# Altium schematic sheet 12V_to_5V_LDO_1A.SchDoc
size A
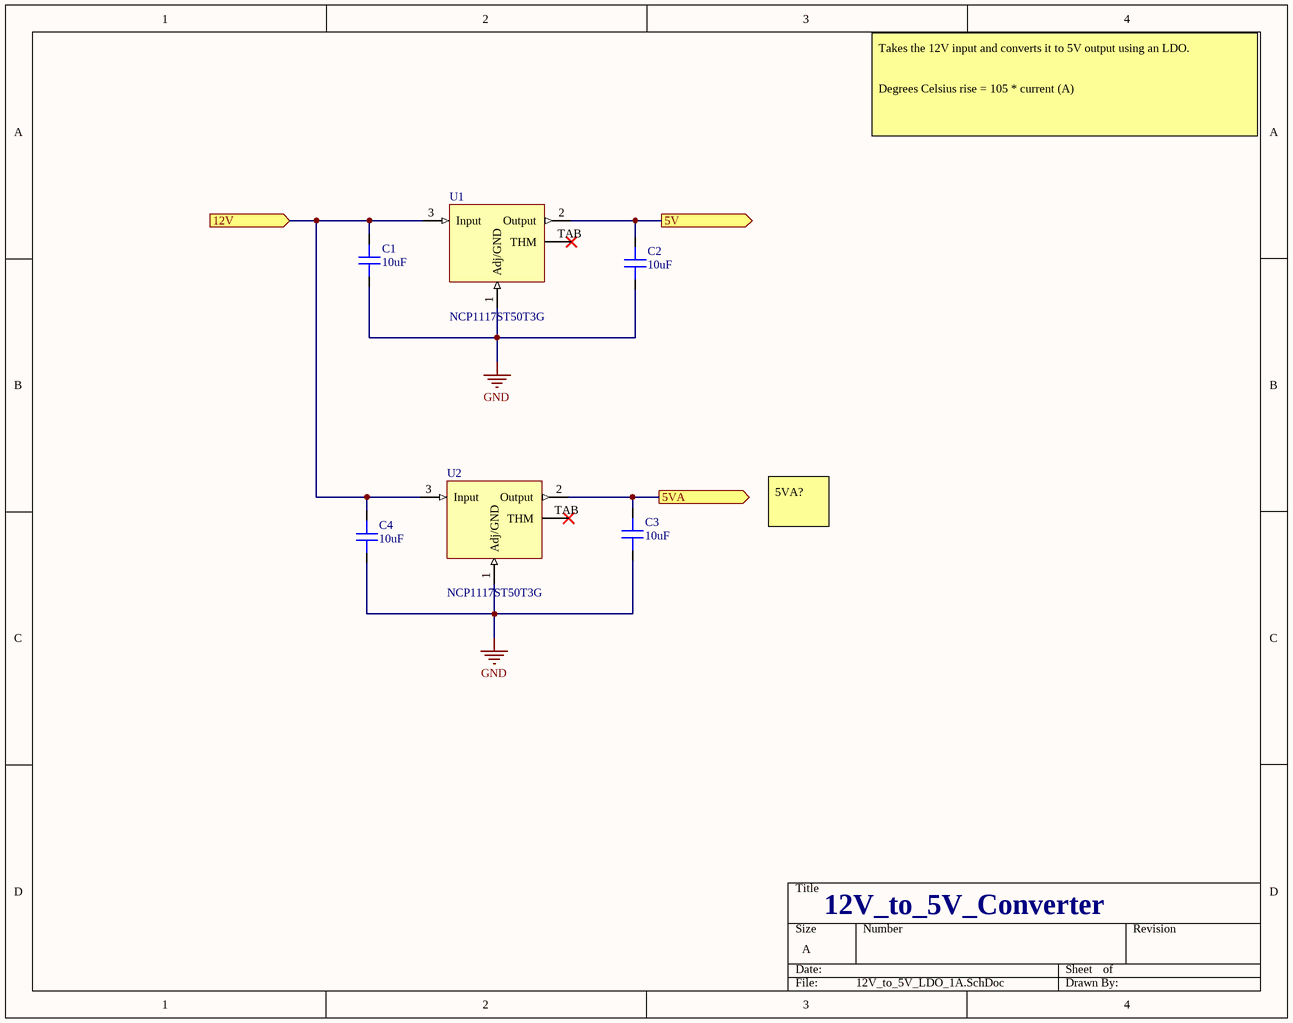
[diagram p0: 12V_to_5V_LDO_1A.SchDoc]

## Parts
C1  capacitance: 10uF  [0603]  (hidden comment: capacitor)
C2  capacitance: 10uF  [0603]  (hidden comment: capacitor)
C3  capacitance: 10uF  [0603]  (hidden comment: capacitor)
C4  capacitance: 10uF  [0603]  (hidden comment: capacitor)
U1  NCP1117ST50T3G  [SOT-223-3]
U2  NCP1117ST50T3G  [SOT-223-3]

## Ports
5V (out), 5VA (out), 12V (in)

## Nets
GND: C1.1 C2.1 C3.1 C4.1 U1.1(Adj/GND) U2.1(Adj/GND)
5V: C2.2 U1.2(Output) ; port 5V
5VA: C3.2 U2.2(Output) ; port 5VA
12V: C1.2 C4.2 U1.3(Input) U2.3(Input) ; port 12V

Not connected (* = marked no-connect by the designer): U1 TAB(THM)*; U2 TAB(THM)*

## Notes on the sheet
- Takes the 12V input and converts it to 5V output using an LDO.
  Degrees Celsius rise = 105 * current (A)
- 5VA?
- 12V_to_5V_Converter

## Library data of the parts
C1-C4 = 1: Generic 0603 capacitor; id: 1; voltage: 50; dielectric: Ceramic; percent tolerance: 10; name: 0603 Capacitor; ESR: 1; package: 0603; quantity: 0
U1 U2 = 16: 5V linear regulator; id: 16; imax: 1; name: NCP1117ST50T3G; package: SOT-223-3; quantity: 0; link: https://www.digikey.com/product-detail/en/on-semiconductor/NCP1117ST50T3G/NCP1117ST50T3GOSCT-ND/1967217